# Altium schematic sheet blackfin_a_sdram.SchDoc: SDRAM
size A3; SheetNumber: 1; SheetTotal: 6
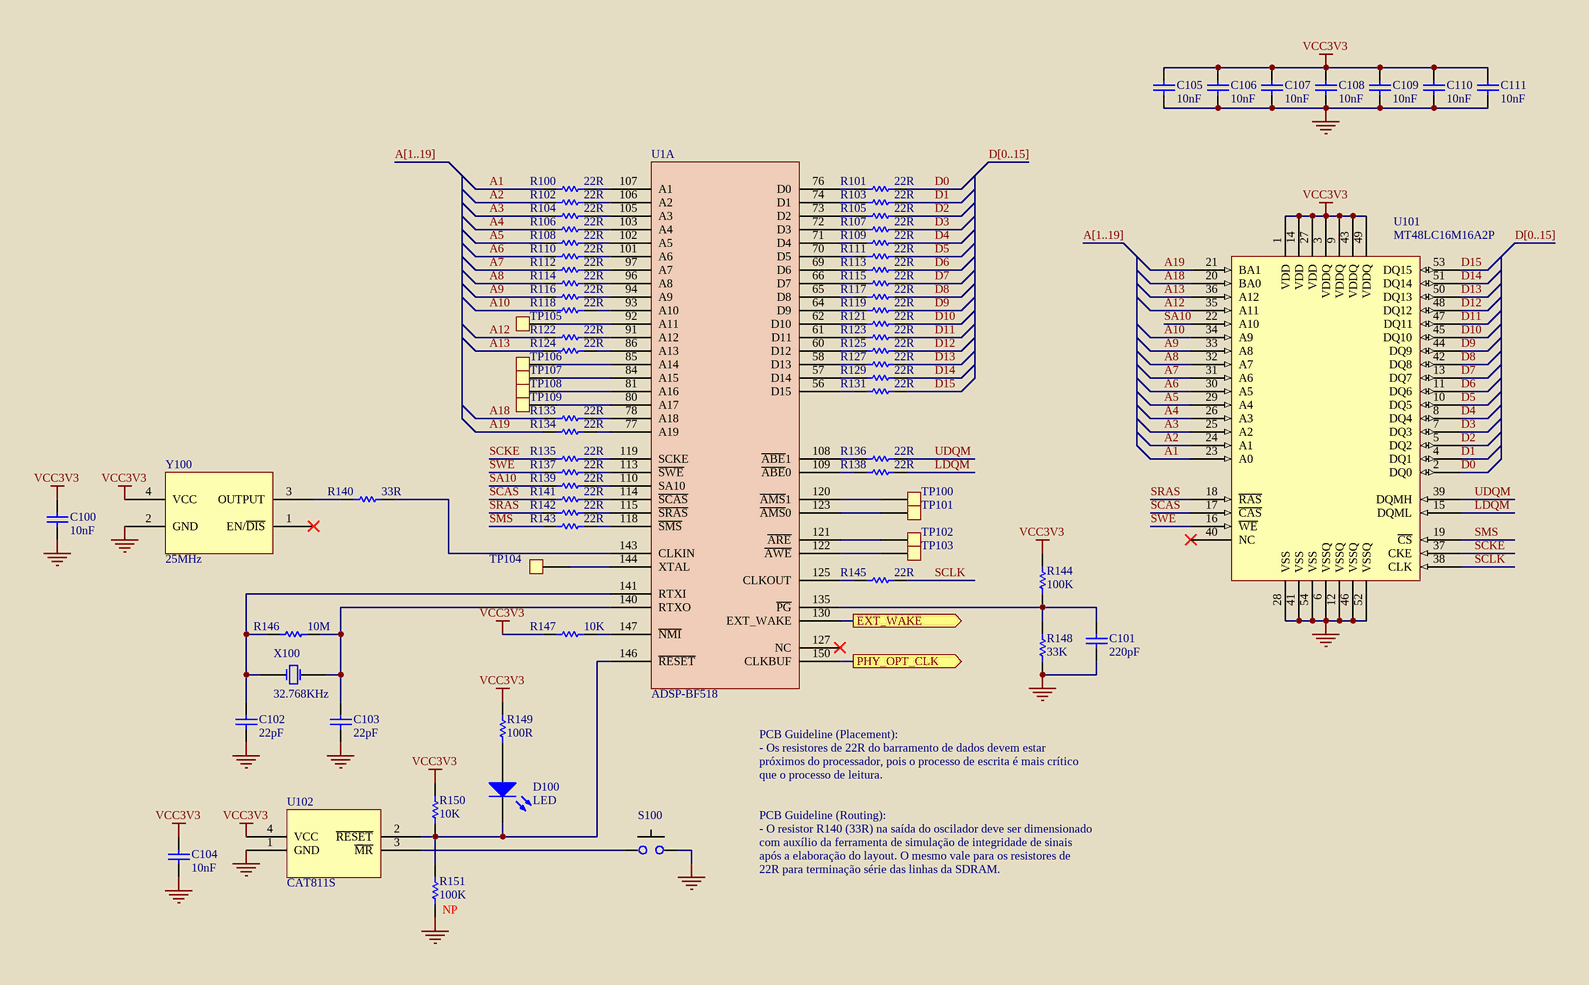
[diagram p0: blackfin_a_sdram.SchDoc]

## Parts
C100  10nF  [C_0603]
C101  220pF  [C_0603]
C102  22pF  [C_0603]
C103  22pF  [C_0603]
C104  10nF  [C_0603]
C105  10nF  [C_0603]
C106  10nF  [C_0603]
C107  10nF  [C_0603]
C108  10nF  [C_0603]
C109  10nF  [C_0603]
C110  10nF  [C_0603]
C111  10nF  [C_0603]
D100  LED  [LED_0603]
R100  22R  [R_0402]
R101  22R  [R_0402]
R102  22R  [R_0402]
R103  22R  [R_0402]
R104  22R  [R_0402]
R105  22R  [R_0402]
R106  22R  [R_0402]
R107  22R  [R_0402]
R108  22R  [R_0402]
R109  22R  [R_0402]
R110  22R  [R_0402]
R111  22R  [R_0402]
R112  22R  [R_0402]
R113  22R  [R_0402]
R114  22R  [R_0402]
R115  22R  [R_0402]
R116  22R  [R_0402]
R117  22R  [R_0402]
R118  22R  [R_0402]
R119  22R  [R_0402]
R121  22R  [R_0402]
R122  22R  [R_0402]
R123  22R  [R_0402]
R124  22R  [R_0402]
R125  22R  [R_0402]
R127  22R  [R_0402]
R129  22R  [R_0402]
R131  22R  [R_0402]
R133  22R  [R_0402]
R134  22R  [R_0402]
R135  22R  [R_0402]
R136  22R  [R_0402]
R137  22R  [R_0402]
R138  22R  [R_0402]
R139  22R  [R_0402]
R140  33R  [R_0402]
R141  22R  [R_0402]
R142  22R  [R_0402]
R143  22R  [R_0402]
R144  100K  [R_0603]
R145  22R  [R_0402]
R146  10M  [R_0603]
R147  10K  [R_0603]
R148  33K  [R_0603]
R149  100R  [R_0603]
R150  10K  [R_0603]
R151  100K  [R_0603]
S100  Push Button  [Push Button]  (value not drawn)
TP100  Test Point  [Test Point]  (value not drawn)  (no BOM)
TP101  Test Point  [Test Point]  (value not drawn)  (no BOM)
TP102  Test Point  [Test Point]  (value not drawn)  (no BOM)
TP103  Test Point  [Test Point]  (value not drawn)  (no BOM)
TP104  Test Point  [Test Point]  (value not drawn)  (no BOM)
TP105  Test Point  [Test Point]  (value not drawn)  (no BOM)
TP106  Test Point  [Test Point]  (value not drawn)  (no BOM)
TP107  Test Point  [Test Point]  (value not drawn)  (no BOM)
TP108  Test Point  [Test Point]  (value not drawn)  (no BOM)
TP109  Test Point  [Test Point]  (value not drawn)  (no BOM)
U1  ADSP-BF518  [LQFP-176]  (part A of 4)
U101  MT48LC16M16A2P  [TSOP-54]
U102  CAT811S  [SOT-143]
X100  32.768KHz  [XTAL_32.768kHz]
Y100  25MHz  [OSC_25MHz]

## Ports
EXT_WAKE (out), PHY_OPT_CLK (out)

## Nets
GND: C100.1 C101.1 C102.1 C103.1 C104.1 C105.1 C106.1 C107.1 C108.1 C109.1 C110.1 C111.1 R148.1 R151.1 S100.2 U101.6(VSSQ) U101.12(VSSQ) U101.28(VSS) U101.41(VSS) U101.46(VSSQ) U101.52(VSSQ) U101.54(VSS) U102.1(GND) Y100.2(GND)
VCC3V3: C100.2 C104.2 C105.2 C106.2 C107.2 C108.2 C109.2 C110.2 C111.2 R144.2 R147.2 R149.2 R150.1 U101.1(VDD) U101.3(VDDQ) U101.9(VDDQ) U101.14(VDD) U101.27(VDD) U101.43(VDDQ) U101.49(VDDQ) U102.4(VCC) Y100.4(VCC)
A1: R100.1 U101.23(A0)
A2: R102.1 U101.24(A1)
A3: R104.1 U101.25(A2)
A4: R106.1 U101.26(A3)
A5: R108.1 U101.29(A4)
A6: R110.1 U101.30(A5)
A7: R112.1 U101.31(A6)
A8: R114.1 U101.32(A7)
A9: R116.1 U101.33(A8)
A10: R118.1 U101.34(A9)
A12: R122.1 U101.35(A11)
A13: R124.1 U101.36(A12)
A18: R133.1 U101.20(BA0)
A19: R134.1 U101.21(BA1)
D0: R101.2 U101.2(DQ0)
D1: R103.2 U101.4(DQ1)
D2: R105.2 U101.5(DQ2)
D3: R107.2 U101.7(DQ3)
D4: R109.2 U101.8(DQ4)
D5: R111.2 U101.10(DQ5)
D6: R113.2 U101.11(DQ6)
D7: R115.2 U101.13(DQ7)
D8: R117.2 U101.42(DQ8)
D9: R119.2 U101.44(DQ9)
D10: R121.2 U101.45(DQ10)
D11: R123.2 U101.47(DQ11)
D12: R125.2 U101.48(DQ12)
D13: R127.2 U101.50(DQ13)
D14: R129.2 U101.51(DQ14)
D15: R131.2 U101.53(DQ15)
EXT_WAKE: U1.130(EXT_WAKE) ; port EXT_WAKE
LDQM: R138.2 U101.15(DQML)
PHY_OPT_CLK: U1.150(CLKBUF) ; port PHY_OPT_CLK
SA10: R139.1 U101.22(A10)
SCAS: R141.1 U101.17(~{CAS})
SCKE: R135.1 U101.37(CKE)
SCLK: R145.2 U101.38(CLK)
SMS: R143.1 U101.19(~{CS})
SRAS: R142.1 U101.18(~{RAS})
SWE: R137.1 U101.16(~{WE})
UDQM: R136.2 U101.39(DQMH)
NetC101_2: C101.2 R144.1 R148.2 U1.135(~{PG})
NetC102_2: C102.2 R146.1 U1.141(RTXI) X100.1(OSC1)
NetC103_2: C103.2 R146.2 U1.140(RTXO) X100.2(OSC2)
NetD100_1: D100.1(A) R149.1
NetD100_2: D100.2(K) R150.2 R151.2 U1.146(~{RESET}) U102.2(~{RESET})
NetR100_2: R100.2 U1.107(A1)
NetR101_1: R101.1 U1.76(D0)
NetR102_2: R102.2 U1.106(A2)
NetR103_1: R103.1 U1.74(D1)
NetR104_2: R104.2 U1.105(A3)
NetR105_1: R105.1 U1.73(D2)
NetR106_2: R106.2 U1.103(A4)
NetR107_1: R107.1 U1.72(D3)
NetR108_2: R108.2 U1.102(A5)
NetR109_1: R109.1 U1.71(D4)
NetR110_2: R110.2 U1.101(A6)
NetR111_1: R111.1 U1.70(D5)
NetR112_2: R112.2 U1.97(A7)
NetR113_1: R113.1 U1.69(D6)
NetR114_2: R114.2 U1.96(A8)
NetR115_1: R115.1 U1.66(D7)
NetR116_2: R116.2 U1.94(A9)
NetR117_1: R117.1 U1.65(D8)
NetR118_2: R118.2 U1.93(A10)
NetR119_1: R119.1 U1.64(D9)
NetR121_1: R121.1 U1.62(D10)
NetR122_2: R122.2 U1.91(A12)
NetR123_1: R123.1 U1.61(D11)
NetR124_2: R124.2 U1.86(A13)
NetR125_1: R125.1 U1.60(D12)
NetR127_1: R127.1 U1.58(D13)
NetR129_1: R129.1 U1.57(D14)
NetR131_1: R131.1 U1.56(D15)
NetR133_2: R133.2 U1.78(A18)
NetR134_2: R134.2 U1.77(A19)
NetR135_2: R135.2 U1.119(SCKE)
NetR136_1: R136.1 U1.108(~{ABE}1)
NetR137_2: R137.2 U1.113(~{SWE})
NetR138_1: R138.1 U1.109(~{ABE}0)
NetR139_2: R139.2 U1.110(SA10)
NetR140_1: R140.1 Y100.3(OUTPUT)
NetR140_2: R140.2 U1.143(CLKIN)
NetR141_2: R141.2 U1.114(~{SCAS})
NetR142_2: R142.2 U1.115(~{SRAS})
NetR143_2: R143.2 U1.118(~{SMS})
NetR145_1: R145.1 U1.125(CLKOUT)
NetR147_1: R147.1 U1.147(~{NMI})
NetS100_1: S100.1 U102.3(~{MR})
NetTP100_1: TP100.1 U1.120(~{AMS}1)
NetTP101_1: TP101.1 U1.123(~{AMS}0)
NetTP102_1: TP102.1 U1.121(~{ARE})
NetTP103_1: TP103.1 U1.122(~{AWE})
NetTP104_1: TP104.1 U1.144(XTAL)
NetTP105_1: TP105.1 U1.92(A11)
NetTP106_1: TP106.1 U1.85(A14)
NetTP107_1: TP107.1 U1.84(A15)
NetTP108_1: TP108.1 U1.81(A16)
NetTP109_1: TP109.1 U1.80(A17)

Not connected (* = marked no-connect by the designer): U1 127(NC)*; U101 40(NC)*; Y100 1(EN/~{DIS})*

## Buses and harness runs
bus A[1..19]
bus D[0..15]

## Notes on the sheet
- PCB Guideline (Placement):
- - Os resistores de 22R do barramento de dados devem estar
- próximos do processador, pois o processo de escrita é mais crítico
- que o processo de leitura.
- PCB Guideline (Routing):
- - O resistor R140 (33R) na saída do oscilador deve ser dimensionado
- com auxílio da ferramenta de simulação de integridade de sinais
- após a elaboração do layout. O mesmo vale para os resistores de
- 22R para terminação série das linhas da SDRAM.
- (near R151) NP
- Título:
- Universidade Federal do Ceará
- Padrão:
- Autor:
- A3
- Rômulo Mendes
- Data:
- Versão:
- Folha:
- V1
- de
- Centro de Tecnologia
- Dep. de Eng. Elétrica
- Dep. de Eng. de Teleinformática
- Arquivo:
- Fortaleza - Ceará - Brasil

## Library data of the parts
C100 C104-C111 = Capacitor: eVendorPart#: 77-VJ0603Y103KXAPBC; Manufacturer: Vishay/Vitramon; Part#: VJ0603Y103KXAPW1BC; eVendor: Mouser; eVendorPrice: 0,05; MSRP: 0,013; MOQ: 1000
C101 = Capacitor: eVendorPart#: 81-GRM18R72A221KA01D; Manufacturer: Murata; Part#: GRM188R72A221KA01D; eVendor: Mouser; eVendorPrice: 0,05; MSRP: 0,012; MOQ: 1000
C102 C103 = Capacitor: eVendorPart#: 581-06035A220J; Manufacturer: AVX; Part#: 06035A220JAT2A; eVendor: Mouser; eVendorPrice: 0,03; MSRP: 0,018; MOQ: 1000
D100 = LED: Red LED; eVendorPart#: 638-QTLP600C2TR; Manufacturer: Everlight; Part#: QTLP600C2TR; eVendor: Mouser; eVendorPrice: 0,22; MSRP: 0,083; MOQ: 1000
R100-R119 R121-R125 R127 R129 R131 R133-R139 R141-R143 R145 = Resistor: eVendorPart#: 71-CRCW0402J-22-E3; Part#: CRCW040222R0JNED; Manufacturer: Vishay/Dale; eVendor: Mouser; eVendorPrice: 0,06; MSRP: 0,01; MOQ: 1000
R140 = Resistor: eVendorPart#: 71-CRCW0402J-33-E3; Part#: CRCW040233R0JNED; Manufacturer: Vishay/Dale; eVendor: Mouser; eVendorPrice: 0,06; MSRP: 0,01; MOQ: 1000
R144 R151 = Resistor: eVendorPart#: 71-CRCW0603J-100K-E3; Part#: CRCW0603100KJNEA; Manufacturer: Vishay/Dale; eVendor: Mouser; eVendorPrice: 0,06; MSRP: 0,01; MOQ: 1000
R146 = Resistor: eVendorPart#: 652-CR0603FX-1005ELF; Part#: CR0603-FX-1005ELF; Manufacturer: Bourns; eVendor: Mouser; eVendorPrice: 0,05; MSRP: 0,004; MOQ: 1000
R147 R150 = Resistor: eVendorPart#: 71-CRCW0603-10K-E3; Part#: CRCW060310K0FKEA; Manufacturer: Vishay/Dale; eVendor: Mouser; eVendorPrice: 0,06; MSRP: 0,015; MOQ: 1000
R148 = Resistor: eVendorPart#: 71-CRCW0603J-33K-E3; Part#: CRCW060333K0JNEA; Manufacturer: Vishay/Dale; eVendor: Mouser; eVendorPrice: 0,06; MSRP: 0,01; MOQ: 1000
R149 = Resistor: eVendorPart#: 71-CRCW0603-100-E3; Part#: CRCW0603100RFKEA; Manufacturer: Vishay/Dale; eVendor: Mouser; eVendorPrice: 0,06; MSRP: 0,015; MOQ: 1000
S100 = Push Button: eVendorPart#: 611-PTS645SH50SMTRLF; Part#: PTS645SH50SMTRLFS; Manufacturer: C&K Components; eVendor: Mouser; MSRP: 0,135; eVendorPrice: 0,27; MOQ: 1000
TP100-TP109 = Test Point: eVendor: NÃO SE APLICA; eVendorPrice: 0,00; eVendorPart#: NÃO SE APLICA; Part#: NÃO SE APLICA; Manufacturer: NÃO SE APLICA; MOQ: 1000; MSRP: 0,00
U1 = ADSP-BF518: eVendorPart#: ADSP-BF518BSWZ-4; eVendor: Analog Devices; eVendorPrice: 13,76; MSRP: 13,07; Part#: ADSP-BF518BSWZ-4; Manufacturer: Analog Devices; MOQ: 1000
U101 = MT48LC16M16A2P: Part#: MT48LC16M16A2P-75:D TR; eVendorPart#: 557-1059-1-ND; Manufacturer: Micron; eVendor: Digikey; eVendorPrice: 10,73; MSRP: 6,6825; MOQ: 1000
U102 = CAT811S: Part#: CAT811STBI-GT3; Manufacturer: ON Semiconductor; eVendorPart#: 698-CAT811STBI-GT3; eVendor: Mouser; eVendorPrice: 0,22; MSRP: 0,156; MOQ: 1000
X100 = XTAL: eVendorPart#: SER2405CT-ND; Part#: MC-405; Manufacturer: Epson; eVendor: Digikey; eVendorPrice: 0,95; MSRP: 0,54; MOQ: 1000
Y100 = Oscillator_25MHz: eVendorPart#: 815-ASV-25-EJ-T; Part#: ASV-25.000MHZ-EJ-T; Manufacturer: ABRACON; eVendor: Mouser; eVendorPrice: 2,89; MSRP: 1,12; MOQ: 1000